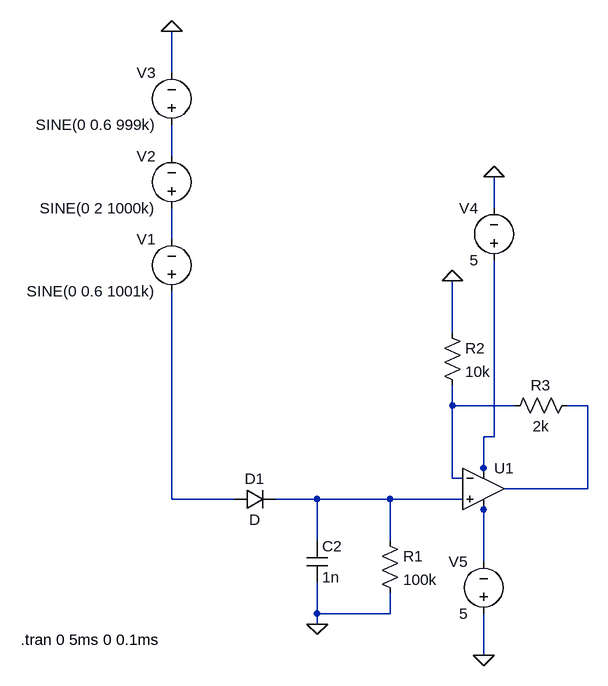
[diagram p0: schematic Electronics_Final_Project.asc]
Electronics_Final_Project.asc, the LTspice schematic file:
Version 4
SHEET 1 936 680
WIRE 0 -304 0 -368
WIRE 0 -176 0 -224
WIRE 496 -96 496 -144
WIRE 0 -48 0 -96
WIRE 432 96 432 16
WIRE 432 208 432 176
WIRE 528 208 432 208
WIRE 640 208 608 208
WIRE 496 256 496 -16
WIRE 496 256 480 256
WIRE 480 304 480 256
WIRE 432 320 432 208
WIRE 448 320 432 320
WIRE 480 320 480 304
WIRE 640 336 640 208
WIRE 640 336 512 336
WIRE 0 352 0 32
WIRE 96 352 0 352
WIRE 224 352 160 352
WIRE 336 352 224 352
WIRE 448 352 336 352
WIRE 480 368 480 352
WIRE 224 416 224 352
WIRE 336 416 336 352
WIRE 480 448 480 368
WIRE 224 528 224 480
WIRE 336 528 336 496
WIRE 336 528 224 528
WIRE 224 544 224 528
WIRE 480 592 480 528
FLAG 224 544 0
FLAG 432 16 0
FLAG 0 -368 0
FLAG 496 -144 0
FLAG 480 592 0
SYMBOL cap 208 416 R0
SYMATTR InstName C2
SYMATTR Value 1n
SYMBOL res 320 400 R0
SYMATTR InstName R1
SYMATTR Value 100k
SYMBOL res 416 80 R0
SYMATTR InstName R2
SYMATTR Value 10k
SYMBOL res 624 192 R90
WINDOW 0 0 56 VBottom 2
WINDOW 3 32 56 VTop 2
SYMATTR InstName R3
SYMATTR Value 2k
SYMBOL voltage 0 48 R180
WINDOW 0 24 96 Left 2
WINDOW 3 24 16 Left 2
WINDOW 123 0 0 Left 0
WINDOW 39 0 0 Left 0
SYMATTR InstName V1
SYMATTR Value SINE(0 0.6 1001k)
SYMBOL voltage 0 -80 R180
WINDOW 0 24 96 Left 2
WINDOW 3 24 16 Left 2
WINDOW 123 0 0 Left 0
WINDOW 39 0 0 Left 0
SYMATTR InstName V2
SYMATTR Value SINE(0 2 1000k)
SYMBOL voltage 0 -208 R180
WINDOW 0 24 96 Left 2
WINDOW 3 24 16 Left 2
WINDOW 123 0 0 Left 0
WINDOW 39 0 0 Left 0
SYMATTR InstName V3
SYMATTR Value SINE(0 0.6 999k)
SYMBOL voltage 496 0 R180
WINDOW 0 24 96 Left 2
WINDOW 3 24 16 Left 2
WINDOW 123 0 0 Left 0
WINDOW 39 0 0 Left 0
SYMATTR InstName V4
SYMATTR Value 5
SYMBOL voltage 480 544 R180
WINDOW 0 24 96 Left 2
WINDOW 3 24 16 Left 2
WINDOW 123 0 0 Left 0
WINDOW 39 0 0 Left 0
SYMATTR InstName V5
SYMATTR Value 5
SYMBOL diode 96 368 R270
WINDOW 0 32 32 VTop 2
WINDOW 3 0 32 VBottom 2
SYMATTR InstName D1
SYMBOL Opamps\\UniversalOpamp2 480 336 R0
SYMATTR InstName U1
TEXT -232 568 Left 2 !.tran 0 5ms 0 0.1ms

The netlist it stands for:
* Electronics_Final_Project.asc
C2 N007 0 1n
R1 N007 0 100k
R2 0 N003 10k
R3 N004 N003 2k
V1 N006 N002 SINE(0 0.6 1001k)
V2 N002 N001 SINE(0 2 1000k)
V3 N001 0 SINE(0 0.6 999k)
V4 N005 0 5
V5 0 N008 5
D1 N006 N007 D
XU1 N007 N003 N005 N008 N004 level.2 Avol=1Meg GBW=10Meg Slew=10Meg ilimit=25m rail=0 Vos=0 phimargin=45 en=0 enk=0 in=0 ink=0 Rin=500Meg  ; pins IN+ IN- V+ V- OUT
.model D D
.lib standard.dio
.tran 0 5ms 0 0.1ms
.lib UniversalOpamps2.sub
.backanno
.end